# EAGLE design transceiver 434MHz v1 (EAGLE 6.4)
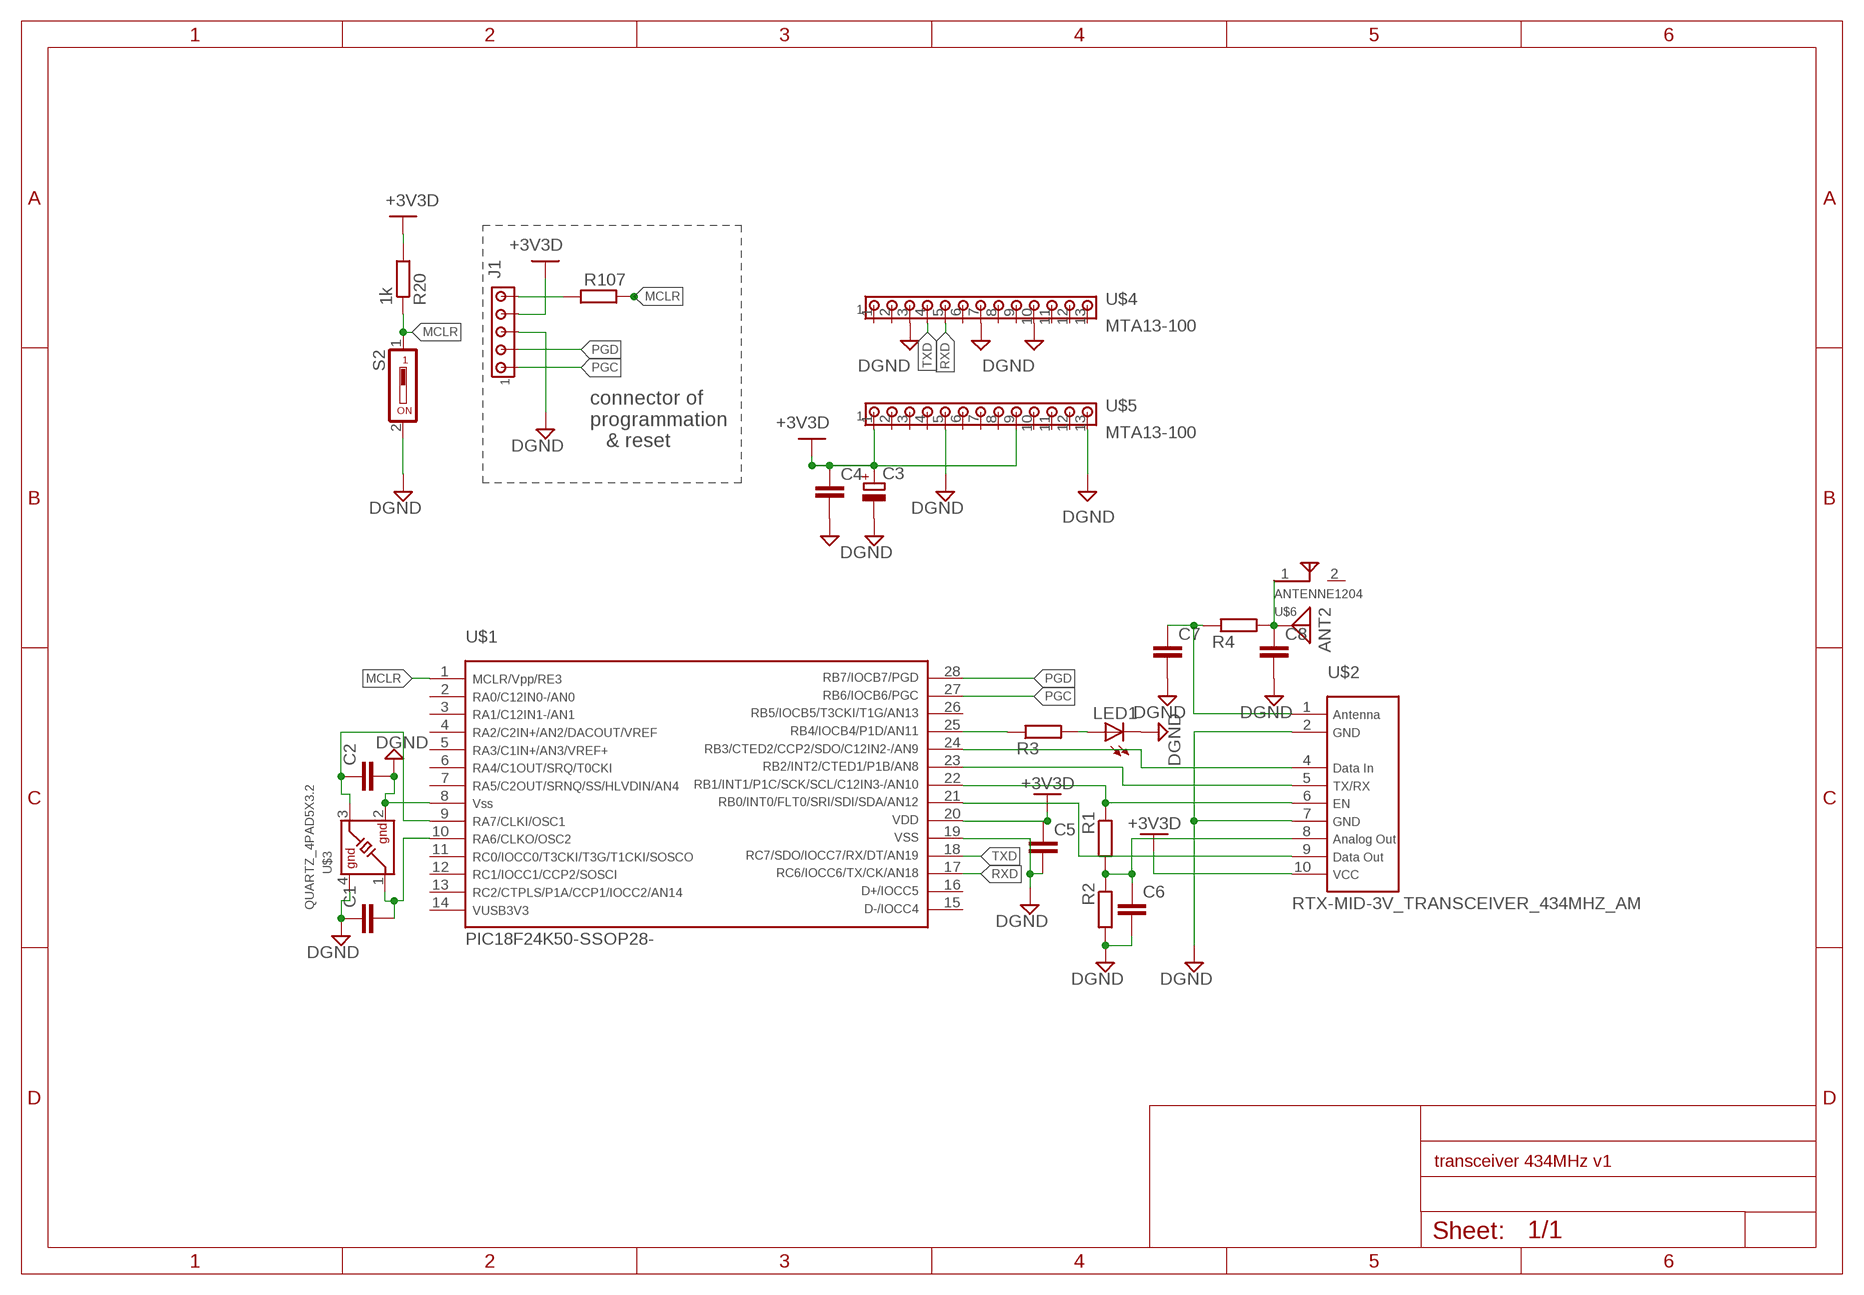
[diagram p0: schematic, sheet 1]

## Parts
ANT2  ANTENNA  [PAD-01]
C1  C-EUC0805  [C0805]
C2  C-EUC0805  [C0805]
C3  CPOL-EUSMCB  [SMC_B]
C4  C-EUC0805  [C0805]
C5  C-EUC0805  [C0805]
C6  C-EUC0805  [C0805]
C7  C-EUC0805  [C0805]
C8  C-EUC0805  [C0805]
J1  MTA05-100  [10X05MTA]
LED1  LEDCHIPLED_0805  [CHIPLED_0805]
R1  R-EU_R0805  [R0805]
R2  R-EU_R0805  [R0805]
R3  R-EU_R0805  [R0805]
R4  R-EU_R0805  [R0805]
R20  1k  R-EU_R0805  [R0805]
R107  R-EU_R0805  [R0805]
S2  DS01  [DS-01]
U$1  PIC18F24K50-SSOP28-  [SOP254P785X200-28N]
U$2  RTX-MID-3V_TRANSCEIVER_434MHZ_AM  [TRASCEIVER-434MHZ_AM]
U$3  QUARTZ_4PAD5X3.2  [OSC_5X3.2]
U$4  MTA13-100  [10X13MTA]
U$5  MTA13-100  [10X13MTA]
U$6  ANTENNE1204  [ANTENNE1204]

## Nets
+3V3D: C3.+ C4.1 C5.1 J1.4 R20.2 U$1.20 U$2.10 U$5.1 U$5.9
DGND: C1.1 C2.2 C3.- C4.2 C5.2 C6.2 C7.2 C8.2 J1.3 LED1.C R2.2 S2.2 U$1.8 U$1.19 U$2.2 U$2.7 U$3.2 U$3.4 U$4.3 U$4.7 U$4.10 U$5.5 U$5.13
MCLR: R20.1 R107.1 S2.1 U$1.1
N$1: U$1.21 U$2.9
N$2: C6.1 R1.2 R2.1 U$2.8
N$3: R1.1 U$1.22 U$2.6
N$4: U$1.23 U$2.5
N$5: U$1.24 U$2.4
N$6: C7.1 R4.1 U$2.1
N$7: R3.1 U$1.25
N$8: LED1.A R3.2
N$10: C1.2 U$1.10 U$3.1
N$11: C2.1 U$1.9 U$3.3
N$12: ANT2.1 C8.1 R4.2 U$6.1
N$105: J1.5 R107.2
PGC: J1.1 U$1.27
PGD: J1.2 U$1.28
RXD: U$1.17 U$4.5
TXD: U$1.18 U$4.4
Unconnected: U$1.2 U$1.3 U$1.4 U$1.5 U$1.6 U$1.7 U$1.11 U$1.12 U$1.13 U$1.14 U$1.15 U$1.16 U$1.26 U$4.1 U$4.2 U$4.6 U$4.8 U$4.9 U$4.11 U$4.12 U$4.13 U$5.2 U$5.3 U$5.4 U$5.6 U$5.7 U$5.8 U$5.10 U$5.11 U$5.12 U$6.2

## Notes on the sheet
- connector of
  programmation
     & reset

## Library data of the parts
ANT2 = discrete:ANTENNA: Antenna
C1 C2 C4-C8 = resistor:C-EU: CAPACITOR, European symbol
C3 = resistor:CPOL-EU: POLARIZED CAPACITOR, European symbol
J1 = julien3:MTA05-100: AMP connector; OC_FARNELL: unknown; OC_NEWARK: unknown
LED1 = led:LED: LED OSRAM: - CHIPLED LG R971, LG N971, LY N971, LG Q971, LY Q971, LO R971, LY R971 LH N974, LH R974 LS Q976, LO Q976, LY Q976 LO Q996 - Hyper CHIPLED LW Q18S LB Q993, LB Q99A, LB R99A - SideLED LS A670, LO A670, LY A670, LG A670, LP A670 LB A673, LV A673, LT A673, LW A673 LH A674 LY A675 LS A676, LA A676, LO A676, LY A676, LW A676 LS A679, LY A679, LG A679 - Hyper Micro SIDELED® LS Y876, LA Y876, LO Y876, LY Y876 LT Y87S - SmartLED LW L88C, LW L88S LB L89C, LB L89S, LG L890 LS L89K, LO L89K, LY L89K LS L896, LA L896, LO L896, LY L896 - TOPLED LS T670, LO T670, LY T670, LG T670, LP T670 LSG T670, LSP T670, LSY T670, LOP T670, LYG T670 LG T671, LOG T671, LSG T671 LB T673, LV T673, LT T673, LW T673 LH T674 LS T676, LA T676, LO T676, LY T676, LB T676, LH T676, LSB T676, LW T676 LB T67C, LV T67C, LT T67C, LS T67K, LO T67K, LY T67K, LW E67C LS E67B, LA E67B, LO E67B, LY E67B, LB E67C, LV E67C, LT E67C LW T67C LS T679, LY T679, LG T679 LS T770, LO T770, LY T770, LG T770, LP T770 LB T773, LV T773, LT T773, LW T773 LH T774 LS E675, LA E675, LY E675, LS T675 LS T776, LA T776, LO T776, LY T776, LB T776 LHGB T686 LT T68C, LB T68C - Hyper Mini TOPLED® LB M676 - Mini TOPLED Santana® LG M470 LS M47K, LO M47K, LY M47K Source: http://www.osram.convergy.de LUXEON: - LUMILED® LXK2-PW12-R00, LXK2-PW12-S00, LXK2-PW14-U00, LXK2-PW14-V00 LXK2-PM12-R00, LXK2-PM12-S00, LXK2-PM14-U00 LXK2-PE12-Q00, LXK2-PE12-R00, LXK2-PE12-S00, LXK2-PE14-T00, LXK2-PE14-U00 LXK2-PB12-K00, LXK2-PB12-L00, LXK2-PB12-M00, LXK2-PB14-N00, LXK2-PB14-P00, LXK2-PB14-Q00 LXK2-PR12-L00, LXK2-PR12-M00, LXK2-PR14-Q00, LXK2-PR14-R00 LXK2-PD12-Q00, LXK2-PD12-R00, LXK2-PD12-S00 LXK2-PH12-R00, LXK2-PH12-S00 LXK2-PL12-P00, LXK2-PL12-Q00, LXK2-PL12-R00 Source: www.luxeon.com KINGBRIGHT: KA-3528ASYC Source: www.kingbright.com
R1-R4 R20 R107 = resistor:R-EU_: RESISTOR, European symbol
S2 = switch-dil:DS01: DIL/CODE SWITCH; OC_FARNELL: unknown; OC_NEWARK: unknown
U$1 = Microchip_By_element14_Batch_1:PIC18F24K50: 28-Pin, Low-Power, High-Performance Microcontrollers with XLP Technology; FARNELL: 2305829
U$2 = julien3:RTX-MID-3V_TRANSCEIVER_434MHZ_AM
U$3 = julien3:QUARTZ_4PAD
U$4 U$5 = con-amp:MTA13-100
U$6 = julien3:ANTENNE1204

## Board
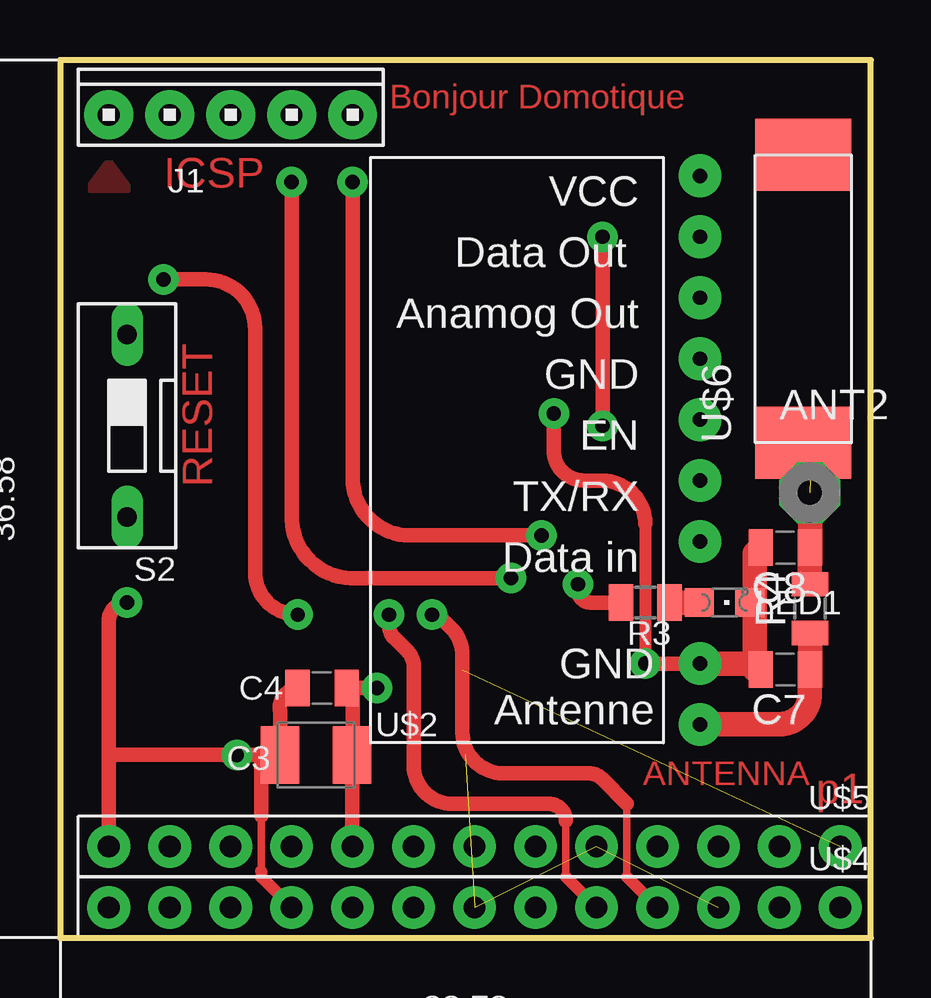
[diagram p1: board, top side]
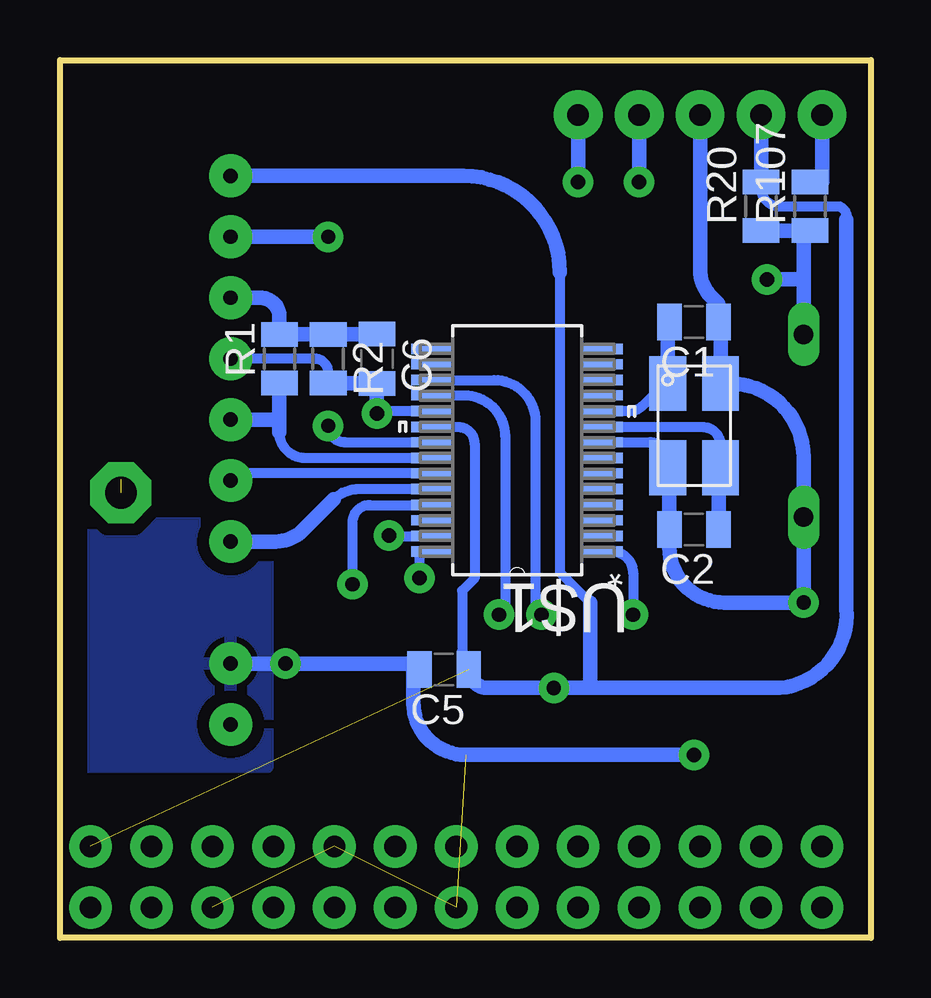
[diagram p2: board, bottom side, seen from below]

Size 33.78 x 36.58 mm. Coordinates in mm from the lower left corner, seen from the top.
Outline: 0,0 33.78,0 33.78,36.58 0,36.58 0,0
Copper layers (1*16): Top 0.035mm / dielectric 1.5mm / Bottom 0.035mm
Design rules "default": minimum track width 10mil, minimum drill 24mil, track to track 8mil, track to pad 8mil, pad to pad 8mil, via to via 8mil, smd to smd 8mil, copper to edge 40mil, drill to drill 8mil, minimum pad ring 10mil, minimum via ring 8mil, stop-mask expansion 4mil, vias tented up to drill 0mil, thermal gap 10mil

### Footprints (pad centres in the part's own frame; a part is rotated, then mirrored left to right if it is on the bottom)
PAD-01 = drill 1.321 pad 2.54 octagon: 1 0,0
C0805 = smd 1.016 x 1.524: 1 -1.028,0; 2 1.028,0
SMC_B = smd 1.6 x 2.4: + -1.5,0; - 1.5,0
10X05MTA = drill 0.9 pad 2.032: 1 5.08,0; 2 2.54,0; 3 0,0; 4 -2.54,0; 5 -5.08,0
CHIPLED_0805 = smd 1.2 x 1.2: A 0,-1.05; C 0,1.05
R0805 = smd 1.016 x 1.524: 1 -1.016,0; 2 1.016,0
DS-01 = drill 0.813 long: 1 0,-3.81; 2 0,3.81
SOP254P785X200-28N = smd 1.651 x 0.432: 1 -3.581,4.216; 2 -3.581,3.581; 3 -3.581,2.921; 4 -3.581,2.286; 5 -3.581,1.626; 6 -3.581,0.965; 7 -3.581,0.33; 8 -3.581,-0.33; 9 -3.581,-0.965; 10 -3.581,-1.626; 11 -3.581,-2.286; 12 -3.581,-2.921; 13 -3.581,-3.581; 14 -3.581,-4.216; 15 3.581,-4.216; 16 3.581,-3.581; 17 3.581,-2.921; 18 3.581,-2.286; 19 3.581,-1.626; 20 3.581,-0.965; 21 3.581,-0.33; 22 3.581,0.33; 23 3.581,0.965; 24 3.581,1.626; 25 3.581,2.286; 26 3.581,2.921; 27 3.581,3.581; 28 3.581,4.216
TRASCEIVER-434MHZ_AM = drill 0.6 pad 1.778: 1 0,0; 2 0,2.54; 4 0,7.62; 5 0,10.16; 6 0,12.7; 7 0,15.24; 8 0,17.78; 9 0,20.32; 10 0,22.86
OSC_5X3.2 = smd 2.286 x 1.524: 1 -1.254,-1.6; 2 2.254,-1.6; 3 2.254,0.6; 4 -1.254,0.6
10X13MTA = drill 0.9 pad 1.778: 1 -12.7,0; 2 -10.16,0; 3 -7.62,0; 4 -5.08,0; 5 -2.54,0; 6 0,0; 7 2.54,0; 8 5.08,0; 9 7.62,0; 10 10.16,0; 11 12.7,0; 12 15.24,0; 13 17.78,0
ANTENNE1204 = smd 3 x 4: 1 -3,-1; 2 9,-1

### Placement (x,y rotation side)
ANT2  31.24,18.54 0 top
C1  7.37,25.65 180 bottom
C2  7.37,17.02 180 bottom
C3  10.67,7.62 180 top
C4  10.92,10.41 180 top
C5  17.78,11.18 180 bottom
C6  20.57,24.13 270 bottom
C7  30.23,11.18 180 top
C8  30.23,16.26 180 top
J1  7.11,34.29 0 top
LED1  27.69,13.97 270 top
R1  24.64,24.13 90 bottom
R2  22.61,24.13 270 bottom
R3  24.38,13.97 0 top
R4  31.24,13.72 90 top
R20  4.57,30.48 90 bottom
R107  2.54,30.48 90 bottom
S2  2.79,21.34 180 top
U$1  14.73,20.32 180 bottom
U$2  26.67,8.89 0 top
U$3  6.86,21.84 270 bottom
U$4  19.81,1.27 180 top
U$5  19.81,3.81 180 top
U$6  29.97,23.62 90 top

### Tracks (layer width: path | path; a pad name or v marks a point on that pad's centre or on a via)
+3V3D  (via drill 0.6 pad 1.27)  (1 unrouted)
  Top 0.406: C3.+ 12.17,6.6 12.19,6.6 12.19,8.13 12.2,8.13 | 12.17,3.81 U$5.9
  Top 0.61: 12.17,6.6 12.17,3.81 | 12.2,8.13 12.19,10.16 12.19,10.41 C4.1 v13.21,10.41
  Bottom 0.406: 16.76,11.22 16.76,11.18 C5.1 17.03,11.96 17.03,14.47 16.51,14.99 16.51,20.6 arc-90 17.19,21.29 U$1.20 | 4.57,31.75 R20.2 4.57,31.24 arc-90 3.81,30.48 1.33,30.48 arc90 1.02,29.91 | 12.95,27.73 12.95,15.24 11.68,13.97
  Bottom 0.61: 16.76,11.22 arc-90 15.96,10.41 v13.21,10.41 11.68,10.41 | R20.2 J1.4 | 1.02,29.91 1.02,13.72 arc90 3.81,10.41 11.68,10.41 | U$2.10 16.97,31.75 arc90 12.95,27.73 | 11.68,13.97 11.68,10.41
DGND  (via drill 0.6 pad 1.27)  (3 unrouted)
  Top 0.305: 8.64,7.62 8.38,7.62 | 8.38,2.79 8.38,5.08
  Top 0.508: 24.38,17.25 v24.38,11.43 | 8.38,2.79 8.38,2.54 U$4.10
  Top 0.61: 8.64,7.62 C3.- 9.17,9.43 arc-90 C4.2 | 8.64,7.62 v7.37,7.62 2.03,7.62 | 2.03,7.62 U$5.13 | 2.03,7.62 2.03,13.21 arc-90 v2.79,13.97 | v20.57,21.84 20.57,20.32 arc90 21.84,19.05 22.59,19.05 arc-90 24.38,17.25 | LED1.C 28.74,11.43 U$2.2 v24.38,11.43 | 8.38,5.08 8.38,7.37 8.64,7.62
  Top 1.016: C8.2 28.96,16.01 28.96,11.18 C7.2 28.94,11.43 U$2.2
  Bottom 0.406: R2.2 22.61,23.56 arc-90 23.17,24.13 U$2.7 | C5.2 19.06,11.43 | U$1.8 9.19,20.65 arc90 8.46,19.92 U$3.2 | 6.35,26.42 6.35,25.67 C1.1 | C6.2 20.57,23.11 | U$1.19 20.57,21.95 v20.57,21.84
  Bottom 0.61: C1.1 6.26,25.57 U$3.4 5.88,23.1 arc90 2.79,20.01 S2.2 v2.79,13.97 6.1,13.97 arc90 8.39,16.27 C2.2 8.39,19.53 U$3.2 | v7.37,7.62 16.88,7.62 arc90 19.06,9.8 19.06,11.43 v24.38,11.43 U$2.2 | J1.3 7.11,27.82 arc-45 6.66,26.73 6.35,26.42 | 20.57,23.11 R2.2 | 20.57,21.95 C6.2
  pour Bottom (isolate 0.508): 25.15,17.27 25.15,7.11 32.77,7.11 32.77,17.27
MCLR  (via drill 0.6 pad 1.27)
  Top 0.61: v4.32,27.43 6.08,27.43 arc-90 8.13,25.38 8.13,15.24 arc90 v9.91,13.46
  Bottom 0.406: R107.1 2.79,29.46 | U$1.1 10.81,16.1 arc90 9.91,15.2 v9.91,13.46
  Bottom 0.61: R20.1 2.79,29.46 2.79,27.43 | S2.1 2.79,27.43 | v4.32,27.43 2.79,27.43
N$1  (via drill 0.6 pad 1.27)
  Top 0.61: v22.61,29.21 v22.61,21.34
  Bottom 0.406: v22.61,21.34 arc-90 21.92,20.65 U$1.21
  Bottom 0.61: U$2.9 v22.61,29.21
N$2
  Bottom 0.406: C6.1 20.57,25.15
  Bottom 0.61: U$2.8 25.44,26.67 arc90 24.64,25.87 R1.2 R2.1 20.57,25.15
N$3
  Bottom 0.406: U$1.22 23.57,19.99 arc90 24.64,21.06
  Bottom 0.61: 24.64,21.06 24.64,21.59 | 24.64,21.59 R1.1 | U$2.6 24.64,21.59
N$4
  Bottom 0.406: U$1.23 26.87,19.35 U$2.5
N$5
  Bottom 0.406: U$1.24 21.34,18.69 arc-45 22.38,18.27
  Bottom 0.61: 22.38,18.27 23.66,16.98 arc45 24.79,16.51 U$2.4
N$6
  Top 1.016: R4.1 31.25,12.7 C7.1 arc90 31.24,11.16 31.24,10.19 arc-90 29.95,8.89 U$2.1
N$7  (via drill 0.6 pad 1.27)
  Top 0.61: R3.1 22.1,13.97 arc-90 21.59,14.48 v21.59,14.73
  Bottom 0.406: v21.59,14.73 21.59,17.32 arc90 20.87,18.03 U$1.25
N$8
  Top 1.016: LED1.A R3.2
N$9
  pour Top: 1.27,31.24 2.03,32.26 2.79,31.24
N$10
  Bottom 0.406: U$3.1 8.64,22.86 8.81,22.86 9.49,22.18 arc45 10.06,21.95 U$1.10
  Bottom 0.61: C1.2 8.46,25.59 U$3.1
N$11
  Bottom 0.406: U$1.9 7.01,21.29 arc90 6.26,20.53 U$3.3
  Bottom 0.61: U$3.3 6.34,19.51 C2.1
N$12  (1 unrouted)
  Top 1.016: U$6.1 31.25,19.1 C8.1 R4.2
N$105
  Bottom 0.61: J1.5 2.03,31.5 R107.2
PGC  (via drill 0.6 pad 1.27)
  Top 0.61: v12.19,31.5 12.19,19.16 arc90 14.59,16.76 v20.07,16.76
  Bottom 0.406: v20.07,16.76 20.07,16.74 U$1.27
  Bottom 0.61: J1.1 v12.19,31.5
PGD  (via drill 0.6 pad 1.27)
  Top 0.61: v9.65,31.5 9.65,17.43 arc90 12.35,14.99 v18.8,14.99
  Bottom 0.406: v18.8,14.99 18.8,16.1 U$1.28
  Bottom 0.61: J1.2 v9.65,31.5
RXD  (via drill 0.6 pad 1.27)
  Top 0.305: 21.08,2.54 21.08,4.87
  Top 0.508: U$4.5 21.08,2.54
  Top 0.61: 21.08,4.87 arc90 20.36,5.59 16.34,5.59 arc-90 14.73,7.19 14.73,11.41 arc45 14.36,12.06 13.94,12.48 arc-45 13.72,13.02 v13.72,13.46
  Bottom 0.406: U$1.17 15.7,23.24 arc90 13.97,21.51 13.97,13.72 arc-90 v13.72,13.46
TXD  (via drill 0.6 pad 1.27)
  Top 0.305: 23.62,5.59 23.62,2.54
  Top 0.508: 23.62,2.54 U$4.4
  Top 0.61: 23.62,5.59 22.59,6.62 arc45 22.02,6.86 18.47,6.86 arc-90 16.76,8.56 16.76,11.77 arc45 16.29,12.92 15.75,13.46 v15.49,13.46
  Bottom 0.406: U$1.18 16.94,22.61 arc90 15.24,20.9 15.24,13.72 arc90 v15.49,13.46

### Text on the board
Top: Bonjour Domotique | ICSP | RESET | ANTENNA | p1